# Altium schematic sheet OZ440-SE110-CAR001-SCH3.SchDoc: Carte IMU GPS: alimentation
size A3; Date: 08/04/14; CheckedBy: GS; Author: BM; DocumentNumber: OZ440-SE110-CAR001-SCH03; Revision: A; SheetNumber: 1; SheetTotal: 1
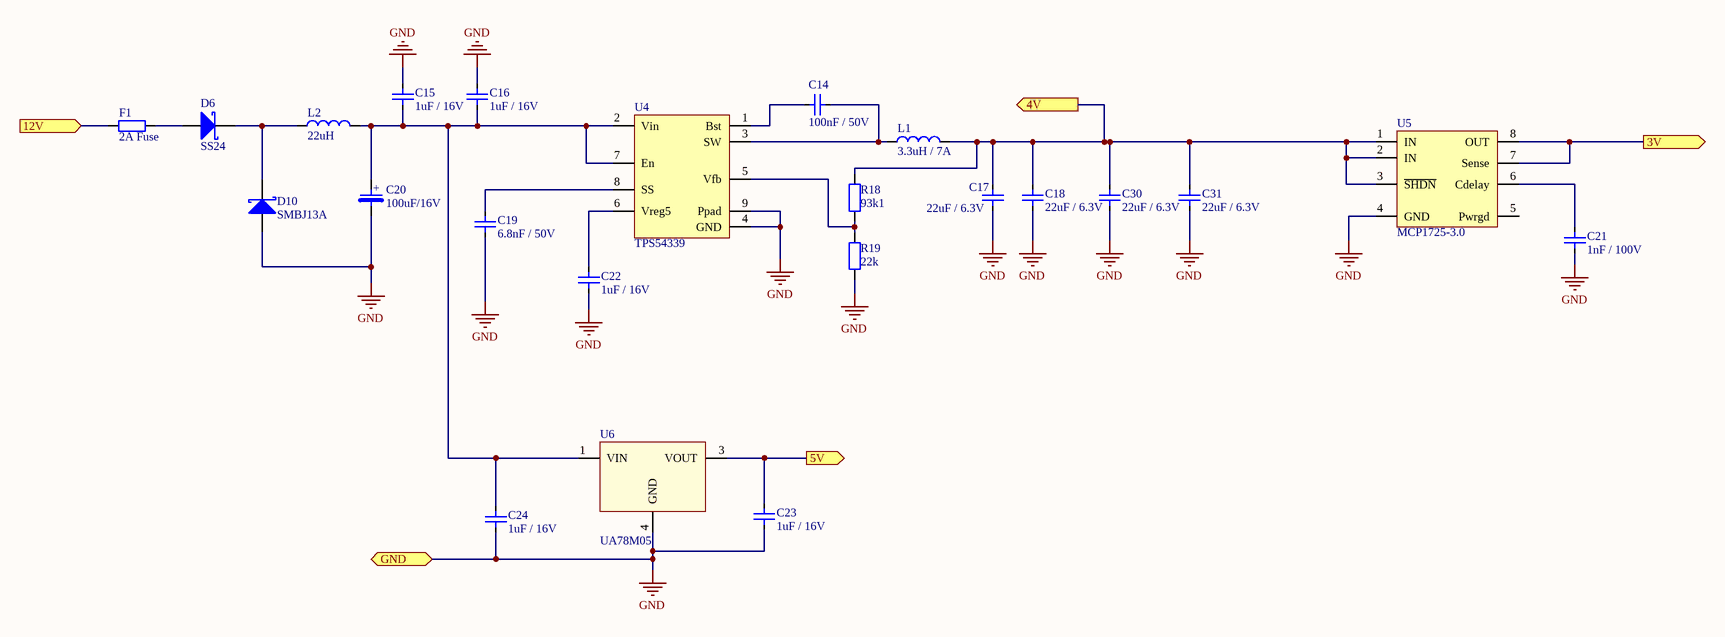
[diagram p0: OZ440-SE110-CAR001-SCH3.SchDoc]

## Parts
C14  Displayed reference: 100nF / 50V  [C0805-STD]  (hidden comment: CAP-SMD)
C15  Displayed reference: 1uF / 16V  [C0805-STD]  (hidden comment: CAP-SMD)
C16  Displayed reference: 1uF / 16V  [C0805-STD]  (hidden comment: CAP-SMD)
C17  Displayed reference: 22uF / 6.3V  [C0805-STD]  (hidden comment: CAP-SMD)
C18  Displayed reference: 22uF / 6.3V  [C0805-STD]  (hidden comment: CAP-SMD)
C19  Displayed reference: 6.8nF / 50V  [C0805-STD]  (hidden comment: CAP-SMD)
C20  Displayed reference: 100uF/16V  [CAP-ELECTRO-SMD]  (hidden comment: CAP-POL-SMD)
C21  Displayed reference: 1nF / 100V  [C0805-STD]  (hidden comment: CAP-SMD)
C22  Displayed reference: 1uF / 16V  [C0805-STD]  (hidden comment: CAP-SMD)
C23  Displayed reference: 1uF / 16V  [C0805-STD]  (hidden comment: CAP-SMD)
C24  Displayed reference: 1uF / 16V  [C0805-STD]  (hidden comment: CAP-SMD)
C30  Displayed reference: 22uF / 6.3V  [C0805-STD]  (hidden comment: CAP-SMD)
C31  Displayed reference: 22uF / 6.3V  [C0805-STD]  (hidden comment: CAP-SMD)
D6  Displayed reference: SS24  [DO214AA-STD]  (hidden comment: DIODE_SCHOTKY-DO214AA)
D10  Displayed reference: SMBJ13A  [DO214AA-STD]  (hidden comment: DIODE_SCHOTKY-DO214AA)
F1  Displayed reference: 2A Fuse  [R0805-STD]  (hidden comment: RES-SMD)
L1  Displayed reference: 3.3uH / 7A  [L-SPE-EPL6024]  (hidden comment: IND-SMD)
L2  Displayed reference: 22uH  [L-SPE-LPS6235]  (hidden comment: IND-SMD)
R18  Displayed reference: 93k1  [R0805-STD]  (hidden comment: RES-SMD)
R19  Displayed reference: 22k  [R0805-STD]  (hidden comment: RES-SMD)
U4  Displayed reference: TPS54339  [SO8_THERMAL-STD]  (hidden comment: TPS54339-SO8)
U5  Displayed reference: MCP1725-3.0  [SO8-STD]  (hidden comment: MCP1725-SO8)
U6  Displayed reference: UA78M05  [TO252-SPE-UA78Mxx]  (hidden comment: uA78MXX-TO252)

## Ports
3V (out), 4V (out), 5V (out), 12V (in), GND

## Nets
GND: C15.2 C16.2 C17.1 C18.1 C19.1 C20.2 C21.1 C22.1 C23.1 C24.1 C30.1 C31.1 D10.A R19.1 U4.4(GND) U4.9(Ppad) U5.4(GND) U6.4(GND) ; port GND
3V: U5.7(Sense) U5.8(OUT) ; port 3V
4V: C17.2 C18.2 C30.2 C31.2 L1.2 R18.2 U5.1(IN) U5.2(IN) U5.3(~{SHDN}) ; port 4V
5V: C23.2 U6.3(VOUT) ; port 5V
12V: F1.1 ; port 12V
NetC14_1: C14.1 U4.1(Bst)
NetC14_2: C14.2 L1.1 U4.3(SW)
NetC15_1: C15.1 C16.1 C20.1 C24.2 L2.2 U4.2(Vin) U4.7(En) U6.1(VIN)
NetC19_2: C19.2 U4.8(SS)
NetC21_2: C21.2 U5.6(Cdelay)
NetC22_2: C22.2 U4.6(Vreg5)
NetD6_A: D6.A F1.2
NetD6_K: D6.K D10.K L2.1
NetR18_1: R18.1 R19.2 U4.5(Vfb)

Not connected (* = marked no-connect by the designer): U5 5(Pwrgd)

## Notes on the sheet
- Titre document:
- NAIO TECHNOLOGIES
- 3 Av didier Daurat
- 31400 TOULOUSE
- Auteur:
- Numéro document:
- Verificateur:
- Format:
- A3
- Date:
- Revision:
- Page:
- /
- (in symbol B41142A4107M) +

## Library data of the parts
C14 = VJ0805Y104KXAxx: 0805 100nF / 50V  X7R ceramic capacitor; Manufacturer: vishay; Max Voltage: 50; Tolerance: +/- 10%; Validated: N; Reference: VJ0805Y104KXAxx; Value: 100nF; Material: X7R; Footprint description: standard Capacitor 0805; Pin Count: 2; helpURL: http://www.vishay.com/docs/45200/highrels.pdf; Supplier 1: Farnell; Supplier Part Number 1: 1612208; Supplier 2: Digi-Key; Supplier Part Number 2: 720-1266-6-ND
C15 C16 C22-C24 = C0805C105K4RACxx: 0805 1uF / 16V X7R ceramic capacitor; Manufacturer: Kemet; Max Voltage: 16; Tolerance: +/- 10%; Validated: N; Reference: C0805C105K4RACxx; Value: 1uF; Material: X7R; Footprint description: standard Capacitor 0805; Pin Count: 2; helpURL: http://www.farnell.com/datasheets/40863.pdf; Supplier 1: Farnell; Supplier Part Number 1: 9227792; Supplier 2: Digi-Key; Supplier Part Number 2: 399-6930-1-ND
C17 C18 C30 C31 = C0805C226M9PACxx: 0805 22uF / 6.3V X5R ceramic capacitor; Manufacturer: Kemet; Max Voltage: 6.3; Tolerance: +/- 20%; Validated: N; Reference: C0805C226M9PACxx; Value: 22uF; Material: X5R; Footprint description: standard Capacitor 0805; Pin Count: 2; helpURL: http://www.farnell.com/datasheets/40863.pdf; Supplier 1: Farnell; Supplier Part Number 1: 1108326; Supplier 2: Digi-Key; Supplier Part Number 2: 399-4696-1-ND
C19 = C0805C682J5GACxx: 0805 6.8nF / 50V COG ceramic capacitor; Manufacturer: Kemet; Max Voltage: 50; Tolerance: +/- 5%; Validated: N; Reference: C0805C682J5GACxx; Value: 6.8nF; Material: COG; Footprint description: standard Capacitor 0805; Pin Count: 2; helpURL: http://www.farnell.com/datasheets/40863.pdf; Supplier 1: Mouser; Supplier Part Number 1: 80-C0805C682J5G; Supplier 2: Farnell; Supplier Part Number 2: 1535571
C20 = B41142A4107M: 100uF/16V Aluminium capacitor SMD; Manufacturer: Epcos; Value: 100uF; Max Voltage: 16V; Reference: B41142A4107M; Material: Aluminium; Footprint description: 6.3mm x 7.7mm; Pin Count: 2; helpURL: www.epcos.com/inf/20/30/db/alu_x/B41142.pdf; Supplier 1: Farnell; Supplier Part Number 1: 1735328; Supplier 2: Mouser; Supplier Part Number 2: 871-B41142A4107M
C21 = VJ0805Y102KXBxx: 0805 1nF / 100V X7R ceramic capacitor; Manufacturer: vishay; Max Voltage: 50; Tolerance: +/- 10%; Validated: N; Reference: VJ0805Y102KXBxx; Value: 1nF; Material: X7R; Footprint description: standard Capacitor 0805; Pin Count: 2; helpURL: http://www.vishay.com/docs/45200/highrels.pdf; Supplier 1: Farnell; Supplier Part Number 1: 1555112; Supplier 2: Digi-Key; Supplier Part Number 2: 720-1264-1-ND
D6 = SS24-E3/xxx: 2A/40V schottky diode in SMB package; Manufacturer: VISHAY; Max Voltage: 40V; Max Current: 2A; Validated: False; Reference: SS24-E3/xxx; component type: DIODE; Footprint description: DO-214AA SMD footprint; Pin Count: 2; Rev: 03/2012; helpURL: http://www.vishay.com/docs/88748/88748.pdf; Supplier 1: Mouser; Supplier Part Number 1: 625-SS24-E3; Supplier 2: Farnell; Supplier Part Number 2: 1843487
D10 = SMBJ13A: 13V TVS diode, 600W; Manufacturer: LITTLEFUSE; Validated: False; Reference: SMBJ13A; component type: DIODE; Max Voltage: 13V; Rated Power: 600W; Footprint description: DO214AA; Pin Count: 2; helpURL: http://www.mouser.com/ds/2/240/Littelfuse_TVS-Diode_SMBJ-48653.pdf; Supplier 1: Farnell; Supplier Part Number 1: 3130150; Supplier 2: Mouser; Supplier Part Number 2: 576-SMBJ13A
F1 = F0805B2R00FWTR: 0805 2A 63V fuse; Manufacturer: AVX; Validated: False; Reference: F0805B2R00FWTR; Max Current: 2A; Pin Count: 2; helpURL: http://www.mouser.com/ds/2/40/accug2-25369.pdf; Supplier 1: Mouser; Supplier Part Number 1: 581-F0805B2R00FWTR; Supplier 2: Digi-Key; Supplier Part Number 2: F0805B2R00FWTR-ND
L1 = EPL6024-332MEB: 3.3uH 7A SMD inductor; Manufacturer: COILCRAFT; Validated: False; Reference: EPL6024-332MEB; Value: 3.3uH; Max Current: 7A; Footprint description: SMD 2 pin; Pin Count: 2; Rev: 5/10/12; helpURL: http://www.coilcraft.com/pdfs/epl6024.pdf; Supplier 1: Mouser; Supplier Part Number 1: 994-EPL6024-332MEB; Supplier 2: Farnell; Supplier Part Number 2: 2287424
L2 = LPS6235-223MR: 22uH SMD inductor; Manufacturer: Coilcraft; Max Current: 1.6A; Validated: False; Reference: LPS6235-223MR; Value: 22uH; Footprint description: SMD 2 pin low profile; Pin Count: 2; Rev: 08/01/13; helpURL: http://www.coilcraft.com/pdfs/lps6235.pdf; Supplier 1: Mouser; Supplier Part Number 1: 994-LPS6235-223MRB; Supplier 2: Farnell; Supplier Part Number 2: 2408291
R18 = CRCW080593K1FKxx: 93k1 Ohm 0805 SMD resistor; Manufacturer: Vishay; Value: 93100; Tolerance: 1%; Rated Power: 0.125W; Validated: No; Reference: CRCW080593K1FKxx; Footprint description: standard 0805 SMD; Pin Count: 2; helpURL: http://www.vishay.com/docs/20035/dcrcwe3.pdf; Supplier 1: Farnell; Supplier Part Number 1: 1278145; Supplier 2: Mouser; Supplier Part Number 2: 71-CRCW0805-93.1K-E3
R19 = CRCW080522K0FKxx: 22k Ohm 0805 SMD resistor; Manufacturer: Vishay; Value: 22 000; Tolerance: 1 %; Rated Power: 0,125 W; Validated: No; Reference: CRCW080522K0FKxx; Footprint description: standard 0805 SMD; Pin Count: 2; helpURL: http://www.vishay.com/docs/20035/dcrcwe3.pdf; Supplier 1: Farnell; Supplier Part Number 1: 1469896; Supplier 2: Mouser; Supplier Part Number 2: 71-CRCW0805-22K-E3
U4 = TPS54339DDA: 4.5 V to 23 V Input, 3-A Step-Down DCDC; Manufacturer: TI; Max Voltage: 23V; Max Current: 3A; Validated: False; Reference: TPS54339DDA; Footprint description: SO8 with thermal PAD; Pin Count: 8; Rev: 01/13; helpURL: http://www.ti.com/lit/ds/symlink/tps54339.pdf; Supplier 1: Mouser; Supplier Part Number 1: 595-TPS54339DDA; Supplier 2: Farnell; Supplier Part Number 2: 2307962
U5 = MCP1725-3002E/SN: low drop, 3V linear regulator; Manufacturer: Microchip; Max Voltage: 6V; Max Current: 0.5A; Validated: False; Reference: MCP1725-3002E/SN; Value: 3V; Footprint description: SO08; Pin Count: 8; Rev: B; helpURL: http://ww1.microchip.com/downloads/en/DeviceDoc/22026b.pdf; Supplier 1: Farnell; Supplier Part Number 1: 1851958; Supplier 2: Mouser; Supplier Part Number 2: 579-MCP1725-3002E/SN
U6 = UA78M05IKVURG3: 5V / 500mA linear regulator; Manufacturer: TI; Max Voltage: 25V; Max Current: 0.5A; Validated: False; Reference: UA78M05IKVURG3; Value: 5V; Footprint description: DPAK; Pin Count: 4; Rev: 05/13; helpURL: http://www.ti.com/lit/ds/symlink/ua78m08.pdf; Supplier 1: Mouser; Supplier Part Number 1: 595-UA78M05CKVURG3; Supplier 2: Farnell; Supplier Part Number 2: 1534754